# Altium schematic sheet DDR3_Memory.SchDoc
size A
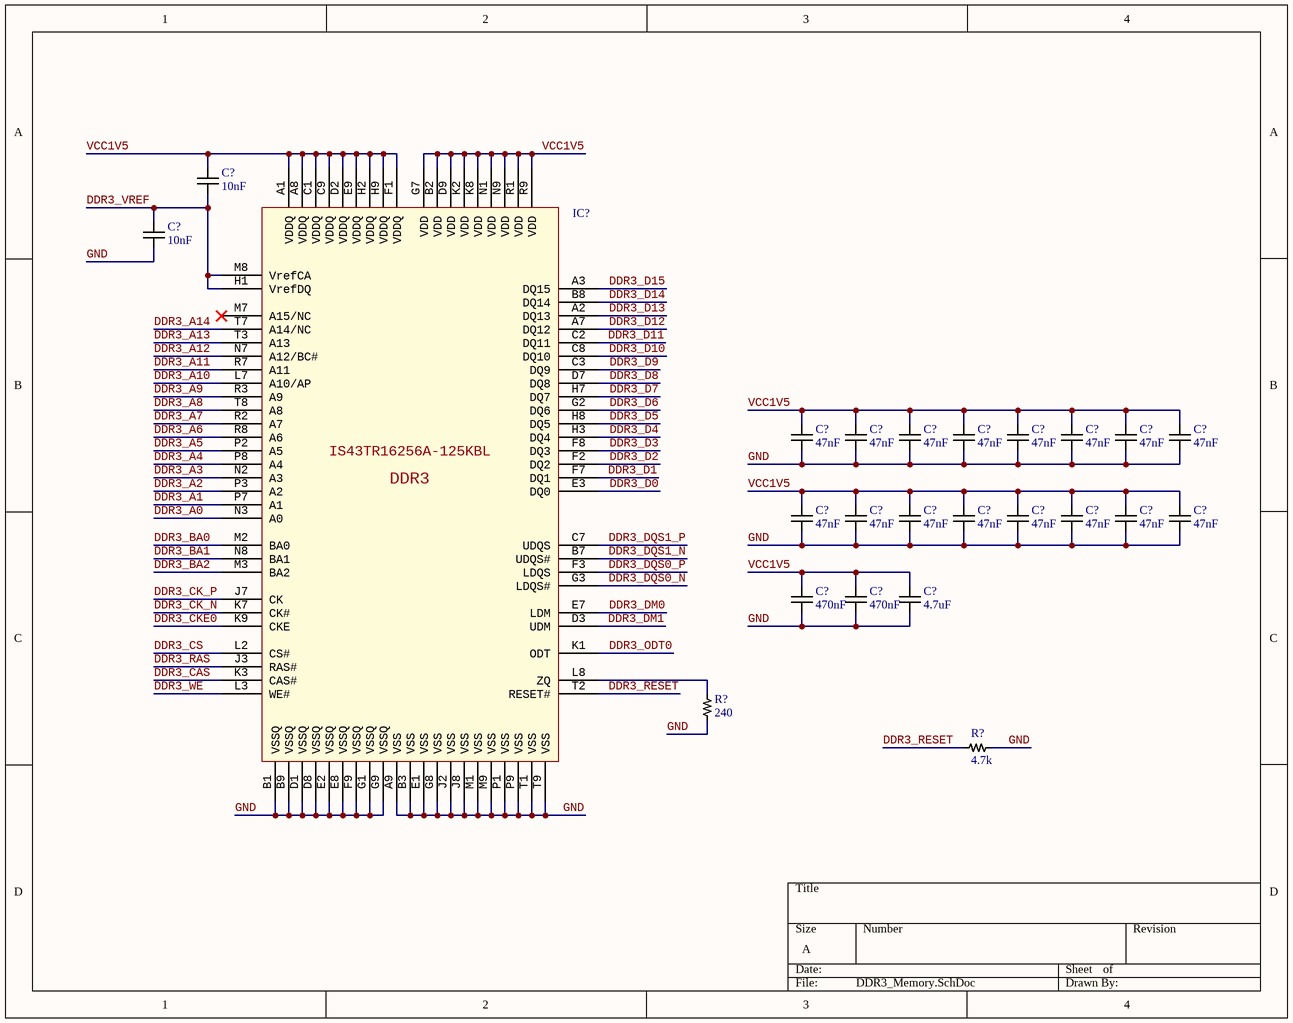
[diagram p0: DDR3_Memory.SchDoc]

## Parts
(Parts that share a designator on the sheet are numbered #1, #2 ... from top to bottom, then left to right.)
C?#1  10nF  [CAP0402]
C?#2  10nF  [CAP0402]
C?#3  47nF  [CAP0402]
C?#4  47nF  [CAP0402]
C?#5  47nF  [CAP0402]
C?#6  47nF  [CAP0402]
C?#7  47nF  [CAP0402]
C?#8  47nF  [CAP0402]
C?#9  47nF  [CAP0402]
C?#10  47nF  [CAP0402]
C?#11  47nF  [CAP0402]
C?#12  47nF  [CAP0402]
C?#13  47nF  [CAP0402]
C?#14  47nF  [CAP0402]
C?#15  47nF  [CAP0402]
C?#16  47nF  [CAP0402]
C?#17  47nF  [CAP0402]
C?#18  47nF  [CAP0402]
C?#19  470nF  [CAP0603]
C?#20  470nF  [CAP0603]
C?#21  4.7uF  [CAP0805]
IC?  IS43TR16256A-125KBL  [BGA96]  (value not drawn)
R?#1  240  [RES0402]
R?#2  4.7k  [RES0402]

## Nets
DDR3_A0: IC?.N3(A0)
DDR3_A1: IC?.P7(A1)
DDR3_A2: IC?.P3(A2)
DDR3_A3: IC?.N2(A3)
DDR3_A4: IC?.P8(A4)
DDR3_A5: IC?.P2(A5)
DDR3_A6: IC?.R8(A6)
DDR3_A7: IC?.R2(A7)
DDR3_A8: IC?.T8(A8)
DDR3_A9: IC?.R3(A9)
DDR3_A10: IC?.L7(A10/AP)
DDR3_A11: IC?.R7(A11)
DDR3_A12: IC?.N7(A12/BC#)
DDR3_A13: IC?.T3(A13)
DDR3_A14: IC?.T7(A14/NC)
DDR3_BA0: IC?.M2(BA0)
DDR3_BA1: IC?.N8(BA1)
DDR3_BA2: IC?.M3(BA2)
DDR3_CAS: IC?.K3(CAS#)
DDR3_CK_N: IC?.K7(CK#)
DDR3_CK_P: IC?.J7(CK)
DDR3_CKE0: IC?.K9(CKE)
DDR3_CS: IC?.L2(CS#)
DDR3_D0: IC?.E3(DQ0)
DDR3_D1: IC?.F7(DQ1)
DDR3_D2: IC?.F2(DQ2)
DDR3_D3: IC?.F8(DQ3)
DDR3_D4: IC?.H3(DQ4)
DDR3_D5: IC?.H8(DQ5)
DDR3_D6: IC?.G2(DQ6)
DDR3_D7: IC?.H7(DQ7)
DDR3_D8: IC?.D7(DQ8)
DDR3_D9: IC?.C3(DQ9)
DDR3_D10: IC?.C8(DQ10)
DDR3_D11: IC?.C2(DQ11)
DDR3_D12: IC?.A7(DQ12)
DDR3_D13: IC?.A2(DQ13)
DDR3_D14: IC?.B8(DQ14)
DDR3_D15: IC?.A3(DQ15)
DDR3_DM0: IC?.E7(LDM)
DDR3_DM1: IC?.D3(UDM)
DDR3_DQS0_N: IC?.G3(LDQS#)
DDR3_DQS0_P: IC?.F3(LDQS)
DDR3_DQS1_N: IC?.B7(UDQS#)
DDR3_DQS1_P: IC?.C7(UDQS)
DDR3_ODT0: IC?.K1(ODT)
DDR3_RAS: IC?.J3(RAS#)
DDR3_RESET: IC?.T2(RESET#) R?#2.1
DDR3_VREF: C?#1.2 C?#2.1 IC?.H1(VrefDQ) IC?.M8(VrefCA)
DDR3_WE: IC?.L3(WE#)
GND: C?#2.2 C?#3.2 C?#4.2 C?#5.2 C?#6.2 C?#7.2 C?#8.2 C?#9.2 C?#10.2 C?#11.2 C?#12.2 C?#13.2 C?#14.2 C?#15.2 C?#16.2 C?#17.2 C?#18.2 C?#19.2 C?#20.2 C?#21.2 IC?.A9(VSS) IC?.B1(VSSQ) IC?.B3(VSS) IC?.B9(VSSQ) IC?.D1(VSSQ) IC?.D8(VSSQ) IC?.E1(VSS) IC?.E2(VSSQ) IC?.E8(VSSQ) IC?.F9(VSSQ) IC?.G1(VSSQ) IC?.G8(VSS) IC?.G9(VSSQ) IC?.J2(VSS) IC?.J8(VSS) IC?.M1(VSS) IC?.M9(VSS) IC?.P1(VSS) IC?.P9(VSS) IC?.T1(VSS) IC?.T9(VSS) R?#1.1 R?#2.2
VCC1V5: C?#1.1 C?#3.1 C?#4.1 C?#5.1 C?#6.1 C?#7.1 C?#8.1 C?#9.1 C?#10.1 C?#11.1 C?#12.1 C?#13.1 C?#14.1 C?#15.1 C?#16.1 C?#17.1 C?#18.1 C?#19.1 C?#20.1 C?#21.1 IC?.A1(VDDQ) IC?.A8(VDDQ) IC?.B2(VDD) IC?.C1(VDDQ) IC?.C9(VDDQ) IC?.D2(VDDQ) IC?.D9(VDD) IC?.E9(VDDQ) IC?.F1(VDDQ) IC?.G7(VDD) IC?.H2(VDDQ) IC?.H9(VDDQ) IC?.K2(VDD) IC?.K8(VDD) IC?.N1(VDD) IC?.N9(VDD) IC?.R1(VDD) IC?.R9(VDD)
NetIC?_L8: IC?.L8(ZQ) R?#1.2

Not connected (* = marked no-connect by the designer): IC? M7(A15/NC)*

## Notes on the sheet
- (in symbol IS43TR16256A-125KBL) DDR3

## Library data of the parts
C?#1 C?#2 = GRM155R71H103KA88D: MLCC 10nF 0402 SMD; Manufacturer: Murata; Material: Ceramic; Tolerance: 10%; Voltage Rating: 50V; Dielectric: X7R; Voltage: 25V; Supplier 1: Digi-Key; Manufacturer Part Number: GRM155R71H103KA88D; Stock 1: 7384657; Pricing 1: 1=0.10000, 10=0.03800, 100=0.01690, 500=0.01208, 1000=0.00949, 2500=0.00862, 5000=0.00794 (USD); RoHS: Yes; Mount: Surface Mount; Case/Package: 0402; Number of Pins: 2; Case Code (Metric): 1005; Case Code (Imperial): 0402; Min Operating Temperature: -55°C; Max Operating Temperature: 125°C; Packaging: Tape and Reel; Package Quantity: 1; Termination: SMD/SMT; Capacitance: 10nF; Voltage Rating (DC): 50V; Length: 1mm; Height: 0.5mm; Width: 0.02inch; Thickness: 0.022inch; Depth: 0.5mm; Radiation Hardening: No; REACH SVHC: No SVHC; Lead Free: Lead Free; ComponentLink1URL: https://datasheet.ciiva.com/129/product-129810.pdf?src-supplier=Digi-Key; ComponentLink1Description: https://datasheet.ciiva.com/129/product-129810.pdf?src-supplier=Digi-Key; ComponentLink2URL: https://datasheet.ciiva.com/19476/1856433-19476546.pdf?src-supplier=Jameco; ComponentLink2Description: https://datasheet.ciiva.com/19476/1856433-19476546.pdf?src-supplier=Jameco; ComponentLink3URL: https://datasheet.ciiva.com/11786/0900766b80ef921d-11786340.pdf?src-supplier=RSComponents; ComponentLink3Description: https://datasheet.ciiva.com/11786/0900766b80ef921d-11786340.pdf?src-supplier=RSComponents; ComponentLink4URL: https://datasheet.ciiva.com/18100/getdatasheetpartid-27434-18100660.pdf?src-supplier=Verical; ComponentLink4Description: https://datasheet.ciiva.com/18100/getdatasheetpartid-27434-18100660.pdf?src-supplier=Verical; ComponentLink5URL: https://datasheet.ciiva.com/22698/1747449-22698420.pdf?src-supplier=Element14; ComponentLink5Description: https://datasheet.ciiva.com/22698/1747449-22698420.pdf?src-supplier=Element14; ComponentLink6URL: https://datasheet.ciiva.com/29199/454225-da-01-en-vs-kondensator-0402-29199740.pdf?src-supplier=Conrad; ComponentLink6Description: https://datasheet.ciiva.com/29199/454225-da-01-en-vs-kondensator-0402-29199740.pdf?src-supplier=Conrad; ComponentLink7URL: https://datasheet.ciiva.com/129/grm155r71h103ka88-01-129811.pdf?src-supplier=Digi-Key; ComponentLink7Description: https://datasheet.ciiva.com/129/grm155r71h103ka88-01-129811.pdf?src-supplier=Digi-Key; ComponentLink8URL: https://datasheet.ciiva.com/129/grm155r71h103ka88-01-129812.pdf?src-supplier=Digi-Key; ComponentLink8Description: https://datasheet.ciiva.com/129/grm155r71h103ka88-01-129812.pdf?src-supplier=Digi-Key; ComponentLink9URL: https://datasheet.ciiva.com/16495/product-16495290.pdf?src-supplier=Future+Electronics; ComponentLink9Description: https://datasheet.ciiva.com/16495/product-16495290.pdf?src-supplier=Future+Electronics; ComponentLink10URL: https://datasheet.ciiva.com/5410/product-5410990.pdf?src-supplier=Mouser; ComponentLink10Description: https://datasheet.ciiva.com/5410/product-5410990.pdf?src-supplier=Mouser
C?#3-C?#18 = GRM155R71E473KA88D: MLCC 47nF 0402 SMD; Manufacturer: Murata; Material: Ceramic; Tolerance: 10%; Voltage Rating: 25V; Dielectric: X7R; Supplier 1: Digi-Key; Manufacturer Part Number: GRM155R71E473KA88D; Stock 1: 1130633; Pricing 1: 1=0.10000, 10=0.06300, 100=0.02820, 500=0.02012, 1000=0.01581, 2500=0.01438, 5000=0.01323 (USD); RoHS: Yes; Mount: Surface Mount; Case/Package: 0402; Number of Pins: 2; Case Code (Metric): 1005; Case Code (Imperial): 0402; Min Operating Temperature: -55°C; Max Operating Temperature: 125°C; Capacitance: 47nF; Package Quantity: 1; Packaging: Tape and Reel; Termination: SMD/SMT; Voltage: 25V; Voltage Rating (DC): 25V; Length: 1mm; Height: 0.5mm; Width: 0.02inch; Thickness: 0.022inch; Depth: 0.5mm; Radiation Hardening: No; REACH SVHC: No SVHC; Lead Free: Lead Free; ComponentLink1URL: https://datasheet.ciiva.com/131/grm155r71e473ka88-01-131494.pdf?src-supplier=Digi-Key; ComponentLink1Description: https://datasheet.ciiva.com/131/grm155r71e473ka88-01-131494.pdf?src-supplier=Digi-Key; ComponentLink2URL: https://datasheet.ciiva.com/34302/1856425-34302854.pdf?src-supplier=Jameco; ComponentLink2Description: https://datasheet.ciiva.com/34302/1856425-34302854.pdf?src-supplier=Jameco; ComponentLink3URL: https://datasheet.ciiva.com/18184/getdatasheetpartid-153136-18184712.pdf?src-supplier=Verical; ComponentLink3Description: https://datasheet.ciiva.com/18184/getdatasheetpartid-153136-18184712.pdf?src-supplier=Verical; ComponentLink4URL: https://datasheet.ciiva.com/29199/454180-da-01-en-vs-kondensator-0402-29199826.pdf?src-supplier=Conrad; ComponentLink4Description: https://datasheet.ciiva.com/29199/454180-da-01-en-vs-kondensator-0402-29199826.pdf?src-supplier=Conrad; ComponentLink5URL: https://datasheet.ciiva.com/2989/product-2989395.pdf?src-supplier=Avnet; ComponentLink5Description: https://datasheet.ciiva.com/2989/product-2989395.pdf?src-supplier=Avnet; ComponentLink6URL: https://datasheet.ciiva.com/131/grm155r71e473ka88-01-131492.pdf?src-supplier=Digi-Key; ComponentLink6Description: https://datasheet.ciiva.com/131/grm155r71e473ka88-01-131492.pdf?src-supplier=Digi-Key; ComponentLink7URL: https://datasheet.ciiva.com/131/grm155r71e473ka88-01-131493.pdf?src-supplier=Digi-Key; ComponentLink7Description: https://datasheet.ciiva.com/131/grm155r71e473ka88-01-131493.pdf?src-supplier=Digi-Key; ComponentLink8URL: https://datasheet.ciiva.com/7937/608985-7937623.pdf?src-supplier=Element14; ComponentLink8Description: https://datasheet.ciiva.com/7937/608985-7937623.pdf?src-supplier=Element14; ComponentLink9URL: https://datasheet.ciiva.com/14103/grmseries-highdielectrictype-eng-14103754.pdf?src-supplier=Distrelec; ComponentLink9Description: https://datasheet.ciiva.com/14103/grmseries-highdielectrictype-eng-14103754.pdf?src-supplier=Distrelec; ComponentLink10URL: https://datasheet.ciiva.com/5424/product-5424844.pdf?src-supplier=Mouser; ComponentLink10Description: https://datasheet.ciiva.com/5424/product-5424844.pdf?src-supplier=Mouser
C?#19 C?#20 = GRM188R70J474KA01D: MLCC 470nF 0603 SMD; pin to pad: 2>none; Manufacturer: Murata; Voltage Rating: 6.3V; Tolerance: 10%; Dielectric: X7R; Supplier 1: Digi-Key; Manufacturer Part Number: GRM188R70J474KA01D; Stock 1: 92537; Pricing 1: 1=0.17000, 10=0.11700, 100=0.05940, 500=0.04066, 1000=0.03597 (USD); RoHS: Yes; Mount: Surface Mount; Case/Package: 0603; Case Code (Metric): 1608; Case Code (Imperial): 0603; Min Operating Temperature: -55°C; Max Operating Temperature: 125°C; Package Quantity: 4000; Capacitance: 470nF; Packaging: Tape and Reel; Voltage Rating (DC): 6.3V; Termination: SMD/SMT; Length: 1.6mm; Height: 0.8mm; Width: 0.031inch; Thickness: 0.035inch; Depth: 0.8mm; Radiation Hardening: No; Lead Free: Lead Free; ComponentLink1URL: https://datasheet.ciiva.com/6264/product-6264161.pdf?src-supplier=Digi-Key; ComponentLink1Description: https://datasheet.ciiva.com/6264/product-6264161.pdf?src-supplier=Digi-Key; ComponentLink2URL: https://datasheet.ciiva.com/11673/product-11673478.pdf?src-supplier=Avnet; ComponentLink2Description: https://datasheet.ciiva.com/11673/product-11673478.pdf?src-supplier=Avnet; ComponentLink3URL: https://datasheet.ciiva.com/6264/partnumbering-e-01-6264159.pdf?src-supplier=Digi-Key; ComponentLink3Description: https://datasheet.ciiva.com/6264/partnumbering-e-01-6264159.pdf?src-supplier=Digi-Key
C?#21 = C2012X7R1A475K085AC: MLCC 4.7uF 0805 SMD; Manufacturer: TDK; Dielectric Material: Ceramic; Tolerance: 10%; Voltage Rating: 10V; Dielectric: X7R; Supplier 1: Digi-Key; Manufacturer Part Number: C2012X7R1A475K085AC; Stock 1: 87407; Pricing 1: 1=0.22000, 10=0.15200, 100=0.08600, 500=0.06072, 1000=0.05313 (USD); RoHS: Yes; Mount: Surface Mount; Case/Package: 0805; Case Code (Metric): 2012; Case Code (Imperial): 0805; Min Operating Temperature: -55°C; Max Operating Temperature: 125°C; Package Quantity: 4000; Packaging: Cut Tape; Capacitance: 4.7uF; Voltage Rating (DC): 10V; Length: 0.079inch; Width: 0.049inch; Thickness: 0.039inch; REACH SVHC: No SVHC; Lead Free: Lead Free; ComponentLink1URL: https://datasheet.ciiva.com/14886/tdkmlcccaprange-14886121.pdf?src-supplier=Digi-Key; ComponentLink1Description: https://datasheet.ciiva.com/14886/tdkmlcccaprange-14886121.pdf?src-supplier=Digi-Key; ComponentLink2Description: https://product.tdk.com/info/en/catalog/datasheets/mlcc_commercial_general_en.pdf; ComponentLink2URL: https://product.tdk.com/info/en/catalog/datasheets/mlcc_commercial_general_en.pdf
IC? = IS43TR16256A-125KBL: DRAM 4G, 1.5V, 1600Mhz DDR3 SDRAM; Manufacturer: ISSI; Max Supply Voltage: 1.575V; Min Supply Voltage: 1.425V; Data Bus Width: 16b; Memory Size: 4Gb; Memory Type: RAM,DDR3 SDRAM; Frequency: 800MHz; Interface: Parallel; Max Supply Current: 290mA; Address Bus Width: 18b; Access Time: 20ns; Nominal Supply Current: 230mA; Supplier 1: Mouser; Manufacturer Part Number: IS43TR16256A-125KBL; Stock 1: 380; Pricing 1: 1=8.69000, 10=8.00000, 25=7.81000, 50=7.81000, 100=7.00000, 250=6.79000, 500=6.46000, 1000=6.46000, 10000=6.46000 (USD); RoHS: Yes; Mount: Surface Mount; Case/Package: TFBGA; Number of Pins: 96; Min Operating Temperature: 0°C; Max Operating Temperature: 95°C; Packaging: Tray; Package Quantity: 190; Max Frequency: 800MHz; Operating Supply Voltage: 1.5V; Density: 4Gb; ComponentLink2URL: http://www.mouser.com/ds/2/198/43-46TR16256A-85120AL-268426.pdf?src-supplier=Mouser; ComponentLink2Description: http://www.mouser.com/ds/2/198/43-46TR16256A-85120AL-268426.pdf?src-supplier=Mouser; ComponentLink1URL: http://components.arrow.com/part/dataview/0323_06942300?src-supplier=Arrow+Europe; ComponentLink1Description: http://components.arrow.com/part/dataview/0323_06942300?src-supplier=Arrow+Europe; ComponentLink3URL: http://www.issi.com/WW/pdf/43-46TR16256A-85120AL.pdf?src-supplier=Digi-Key; ComponentLink3Description: http://www.issi.com/WW/pdf/43-46TR16256A-85120AL.pdf?src-supplier=Digi-Key
R?#1 = RC0402FR-07240RL: Resistor 240Ohm 0402 SMD; Manufacturer: Yageo Phycomp; Tolerance: 1%; Power Rating: 63mW; Temperature Coefficient: 100ppm/°C; Voltage Rating (DC): 50V; Resistance: 240R; Supplier 1: Digi-Key; Manufacturer Part Number: RC0402FR-07240RL; Stock 1: 5368761; Pricing 1: 1=0.10000, 10=0.01600, 100=0.00670, 1000=0.00301, 2500=0.00261, 5000=0.00215 (USD); RoHS: Yes; Mount: Surface Mount; Case/Package: 0402; Number of Pins: 2; Min Operating Temperature: -55°C; Max Operating Temperature: 155°C; Packaging: Cut Tape; Length: 1mm; Height: 0.32mm; Depth: 0.5mm; REACH SVHC: No SVHC; Lead Free: Lead Free; ComponentLink1URL: http://www.mouser.com/ds/2/447/PYu-RC0402_51_RoHS_L_6_r-8721.pdf?src-supplier=Mouser; ComponentLink1Description: http://www.mouser.com/ds/2/447/PYu-RC0402_51_RoHS_L_6_r-8721.pdf?src-supplier=Mouser; ComponentLink2URL: http://www.farnell.com/datasheets/2167052.pdf?src-supplier=Farnell; ComponentLink2Description: http://www.farnell.com/datasheets/2167052.pdf?src-supplier=Farnell; ComponentLink3URL: http://www.yageo.com/documents/recent/PYu-RC_Group_51_RoHS_L_9.pdf?src-supplier=Digi-Key; ComponentLink3Description: http://www.yageo.com/documents/recent/PYu-RC_Group_51_RoHS_L_9.pdf?src-supplier=Digi-Key; ComponentLink4URL: http://www.yageo.com/documents/recent/PYu-RC_Group_51_RoHS_L_10.pdf?src-supplier=Digi-Key; ComponentLink4Description: http://www.yageo.com/documents/recent/PYu-RC_Group_51_RoHS_L_10.pdf?src-supplier=Digi-Key; ComponentLink5URL: http://www.farnell.com/datasheets/2167052.pdf?src-supplier=Element14; ComponentLink5Description: http://www.farnell.com/datasheets/2167052.pdf?src-supplier=Element14
R?#2 = RC0402FR-074K7L: Resistor 4.7kOhm 0402 SMD; Manufacturer: Yageo; Voltage Rating (DC): 50V; Tolerance: 1%; Power Rating: 62.5mW; Resistance: 4.7kR; Temperature Coefficient: 100ppm/°C; Supplier 1: Digi-Key; Manufacturer Part Number: RC0402FR-074K7L; Stock 1: 23742940; Pricing 1: 1=0.10000, 10=0.01600, 100=0.00670, 1000=0.00301, 2500=0.00261, 5000=0.00215 (USD); RoHS: Yes; Case/Package: 0402; Number of Pins: 2; Case Code (Imperial): 0402; Case Code (Metric): 1005; Min Operating Temperature: -55°C; Max Operating Temperature: 155°C; Voltage Rating: 50V; Packaging: Tape and Reel; Composition: Thick Film; Termination: SMD/SMT; Military Standard: Not; Length: 1mm; Height: 0.32mm; Width: 0.5mm; Depth: 0.5mm; REACH SVHC: No SVHC; Lead Free: Lead Free; ComponentLink1URL: https://datasheet.ciiva.com/7850/1018594-7850022.pdf?src-supplier=Element14; ComponentLink1Description: https://datasheet.ciiva.com/7850/1018594-7850022.pdf?src-supplier=Element14; ComponentLink2URL: https://datasheet.ciiva.com/7850/1018594-7850023.pdf?src-supplier=Element14; ComponentLink2Description: https://datasheet.ciiva.com/7850/1018594-7850023.pdf?src-supplier=Element14; ComponentLink3URL: https://datasheet.ciiva.com/15215/getdatasheetpartid-328119-15215035.pdf?src-supplier=Verical; ComponentLink3Description: https://datasheet.ciiva.com/15215/getdatasheetpartid-328119-15215035.pdf?src-supplier=Verical; ComponentLink4URL: https://datasheet.ciiva.com/22661/1686128-22661342.pdf?src-supplier=Element14; ComponentLink4Description: https://datasheet.ciiva.com/22661/1686128-22661342.pdf?src-supplier=Element14